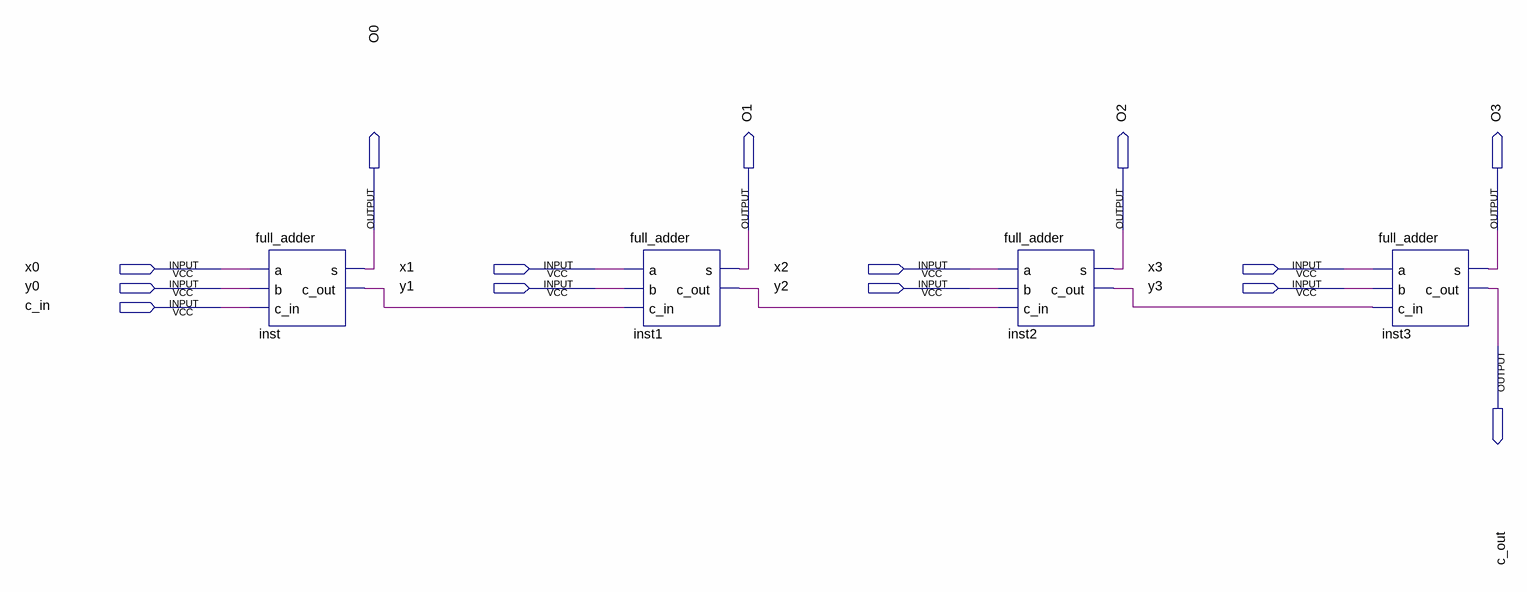
[diagram p0: schematic sheet]
// Quartus schematic ADDER4.bdf as structural Verilog: 4 symbols, 14 pins
module ADDER4 (
  input  x0,
  input  x1,
  input  x2,
  input  x3,
  input  y0,
  input  y1,
  input  y2,
  input  y3,
  input  c_in,
  output O0,
  output O1,
  output O2,
  output O3,
  output c_out
);

  wire inst1_c_out, inst2_c_out, inst_c_out;

  full_adder inst (.a(x0), .b(y0), .c_in(c_in), .s(O0), .c_out(inst_c_out));
  full_adder inst1 (.a(x1), .b(y1), .c_in(inst_c_out), .s(O1), .c_out(inst1_c_out));
  full_adder inst2 (.a(x2), .b(y2), .c_in(inst1_c_out), .s(O2), .c_out(inst2_c_out));
  full_adder inst3 (.a(x3), .b(y3), .c_in(inst2_c_out), .s(O3), .c_out(c_out));
endmodule
